# EAGLE design howland_vccs_differential (EAGLE 6.4)
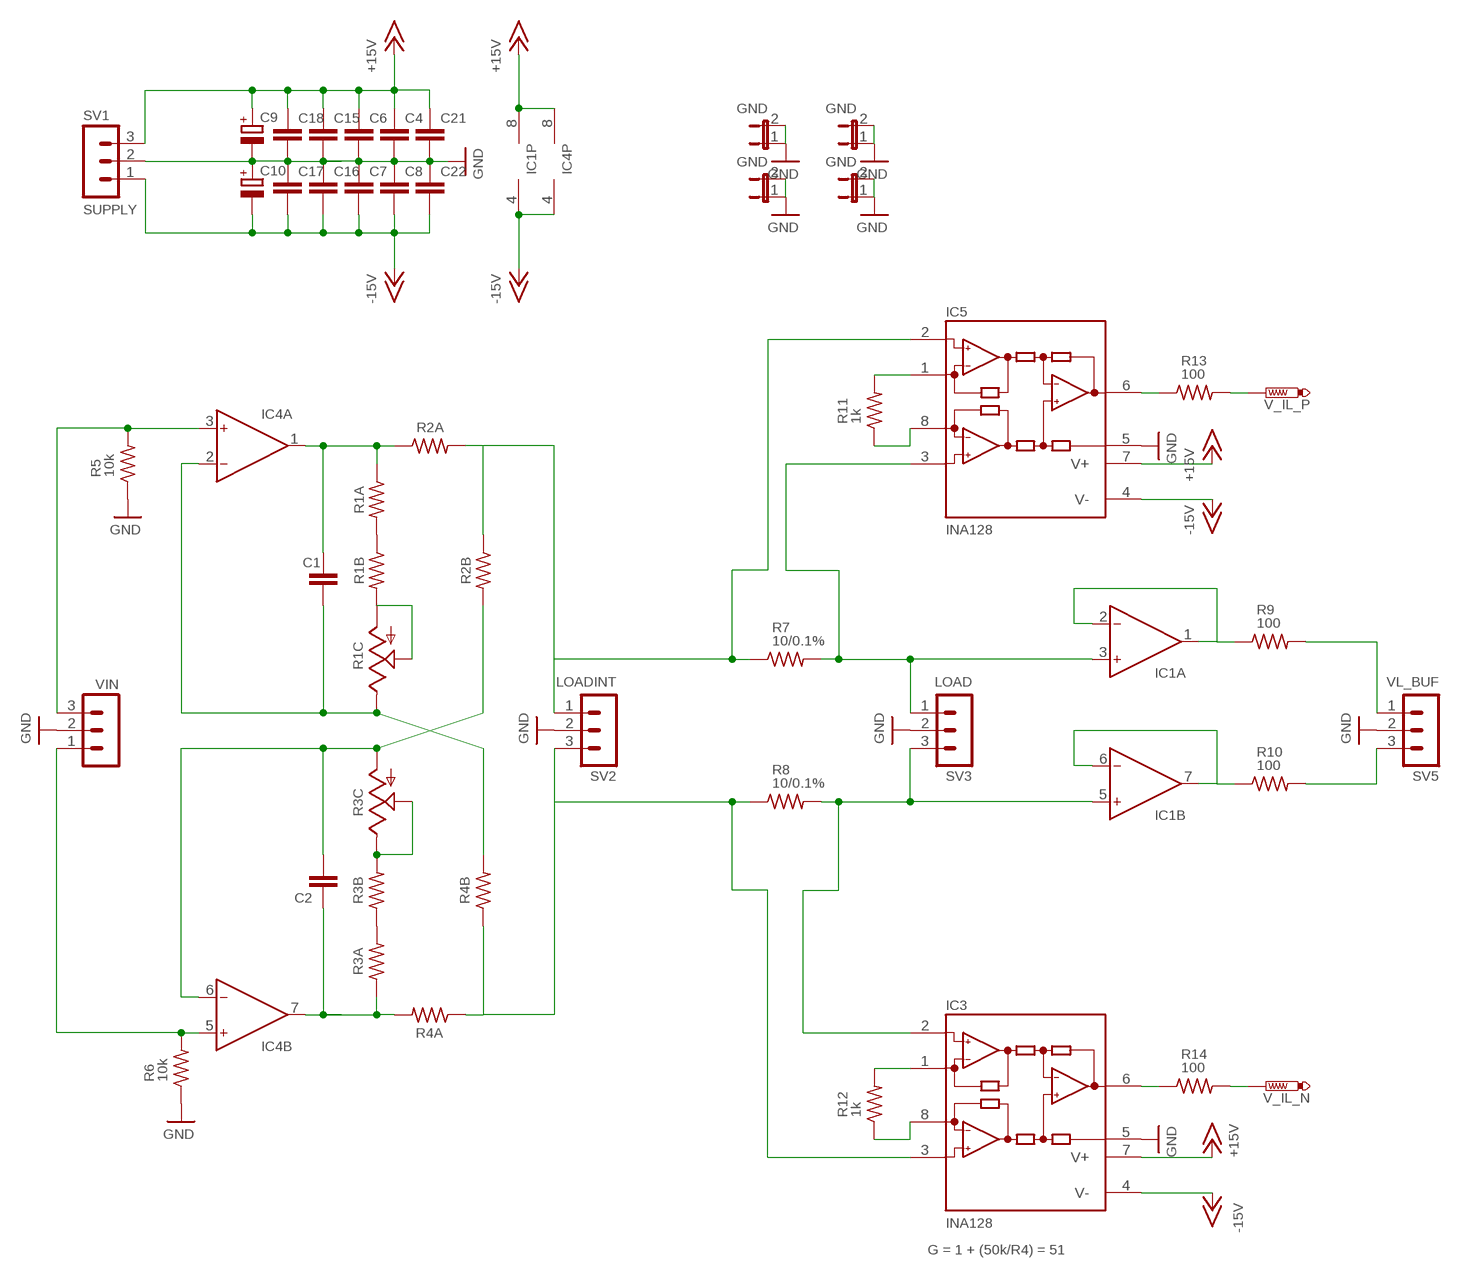
[diagram p0: schematic, sheet 1]

## Parts
C1  C-EUC1206  [C1206]
C2  C-EUC1206  [C1206]
C4  C-EUC1206  [C1206]
C6  C-EUC1206  [C1206]
C7  C-EUC1206  [C1206]
C8  C-EUC1206  [C1206]
C9  CPOL-EUC/6032-28R  [C/6032-28R]
C10  CPOL-EUC/6032-28R  [C/6032-28R]
C15  C-EUC1206  [C1206]
C16  C-EUC1206  [C1206]
C17  C-EUC1206  [C1206]
C18  C-EUC1206  [C1206]
C21  C-EUC1206  [C1206]
C22  C-EUC1206  [C1206]
IC1  OPA2192  AD826R  [SO8]
IC3  INA128  INA128U  [SO08]
IC4  OPA2192  AD826R  [SO8]
IC5  INA128  INA128U  [SO08]
JP8  GND  JP1E  [JP1]
JP10  GND  JP1E  [JP1]
JP11  GND  JP1E  [JP1]
JP12  GND  JP1E  [JP1]
R1A  R-US_R1206  [R1206]
R1B  R-US_R1206  [R1206]
R1C  TRIM_US-3223J  [3223J]
R2A  R-US_R1206  [R1206]
R2B  R-US_R1206  [R1206]
R3A  R-US_R1206  [R1206]
R3B  R-US_R1206  [R1206]
R3C  TRIM_US-3223J  [3223J]
R4A  R-US_R1206  [R1206]
R4B  R-US_R1206  [R1206]
R5  10k  R-US_R1206  [R1206]
R6  10k  R-US_R1206  [R1206]
R7  10/0.1%  R-US_R1206  [R1206]
R8  10/0.1%  R-US_R1206  [R1206]
R9  100  R-US_R1206  [R1206]
R10  100  R-US_R1206  [R1206]
R11  1k  R-US_R1206  [R1206]
R12  1k  R-US_R1206  [R1206]
R13  100  R-US_R1206  [R1206]
R14  100  R-US_R1206  [R1206]
SV1  SUPPLY  MA03-1  [MA03-1]
SV2  LOADINT  MA03-1  [MA03-1]
SV3  LOAD  MA03-1  [MA03-1]
SV5  VL_BUF  MA03-1  [MA03-1]
V_IL_N  PTR1PAD1-13  [P1-13]
V_IL_P  PTR1PAD1-13  [P1-13]
VIN  MA03-1  [MA03-1]

## Nets
+15V: C4.1 C6.1 C9.+ C15.1 C18.1 C21.1 IC1.8(P:V+) IC3.7(V+) IC4.8(P:V+) IC5.7(V+) SV1.3
-15V: C7.2 C8.2 C10.- C16.2 C17.2 C22.2 IC1.4(P:V-) IC3.4(V-) IC4.4(P:V-) IC5.4(V-) SV1.1
GND: C4.2 C6.2 C7.1 C8.1 C9.- C10.+ C15.2 C16.1 C17.1 C18.2 C21.2 C22.1 IC3.5(REF) IC5.5(REF) JP8.1 JP8.2 JP10.1 JP10.2 JP11.1 JP11.2 JP12.1 JP12.2 R5.1 R6.1 SV1.2 SV2.2 SV3.2 SV5.2 VIN.2
N$1: IC5.2(-IN) R2A.2 R2B.1 R7.1 SV2.1
N$2: C1.2 IC4.2(A:IN-) R1C.3(E) R4B.2
N$3: C1.1 IC4.1(A:OUT) R1A.1 R2A.1
N$5: IC1.6(B:IN-) IC1.7(B:OUT) R10.1
N$6: R1B.2 R1C.1(A) R1C.2(S)
N$7: IC3.1(RG) R12.2
N$8: IC3.8(RG) R12.1
N$9: IC3.6(OUT) R14.1
N$11: R1A.2 R1B.1
N$12: IC1.1(A:OUT) IC1.2(A:IN-) R9.1
N$14: IC4.5(B:IN+) R6.2 VIN.1
N$15: IC4.3(A:IN+) R5.2 VIN.3
N$16: R10.2 SV5.3
N$17: R14.2 V_IL_N.TP
N$18: R9.2 SV5.1
N$19: C2.2 IC4.6(B:IN-) R2B.2 R3C.1(A)
N$22: C2.1 IC4.7(B:OUT) R3A.1 R4A.2
N$24: R3B.2 R3C.2(S) R3C.3(E)
N$25: IC5.1(RG) R11.2
N$27: IC5.8(RG) R11.1
N$28: IC5.6(OUT) R13.1
N$29: R13.2 V_IL_P.TP
N$30: IC1.3(A:IN+) IC5.3(+IN) R7.2 SV3.1
N$31: R3A.2 R3B.1
N$38: IC3.3(+IN) R4A.1 R4B.1 R8.1 SV2.3
N$39: IC1.5(B:IN+) IC3.2(-IN) R8.2 SV3.3

## Notes on the sheet
- G = 1 + (50k/R4) = 51

## Library data of the parts
C1 C2 C4 C6-C8 C15-C18 C21 C22 = rcl:C-EU: CAPACITOR, European symbol
C9 C10 = rcl:CPOL-EU: POLARIZED CAPACITOR, European symbol
IC1 IC4 = analog-devices:AD826: High-Speed, Low-Power Dual Operational Amplifier Source: http://www.analog.com/static/imported-files/data_sheets/AD826.pdf; MF: ALTERA CORPORATION; MPN: AD826AR; OC_FARNELL: 1651291; OC_NEWARK: 05F7688
IC3 IC5 = burr-brown:INA128: Instrumentation Amplifiers Precision, Low Power; MF: TEXAS INSTRUMENTS; MPN: INA128U; OC_FARNELL: 1212413; OC_NEWARK: 35C1729
JP8 JP10-JP12 = jumper:JP1E: JUMPER
R1A R1B R2A R2B R3A R3B R4A R4B R5-R14 = rcl:R-US_: RESISTOR, American symbol
R1C R3C = pot:TRIM_US-: POTENTIOMETER
SV1 = con-lstb:MA03-1: PIN HEADER; OC_FARNELL: unknown; OC_NEWARK: unknown
SV2 SV3 SV5 VIN = sil_header_3:MA03-1: PIN HEADER; OC_FARNELL: unknown; OC_NEWARK: unknown
V_IL_N V_IL_P = testpad:PTR1: TEST PIN

## Board
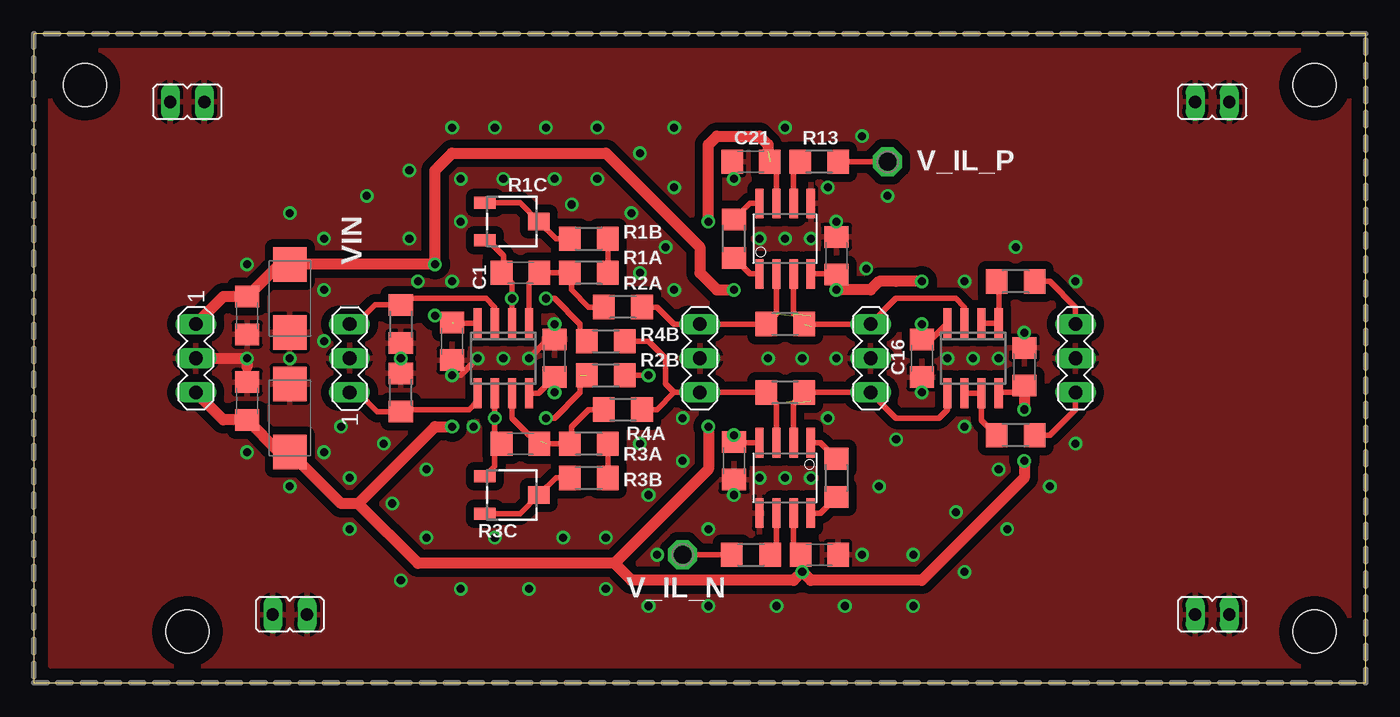
[diagram p1: board, top side]
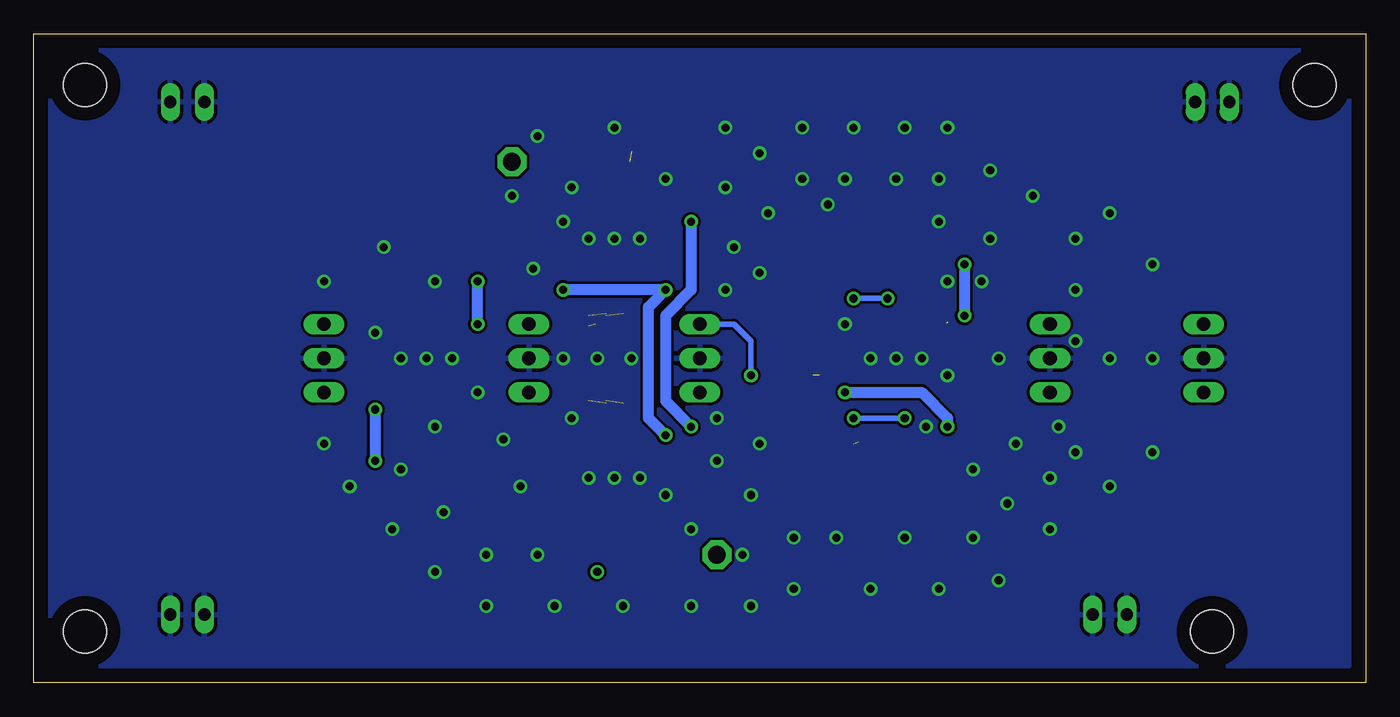
[diagram p2: board, bottom side, seen from below]

Size 99.06 x 48.26 mm. Coordinates in mm from the lower left corner, seen from the top.
Outline: 0,0 99.06,0 99.06,48.26 0,48.26 0,0
Copper layers (1*16): Top 0.035mm / dielectric 1.5mm / Bottom 0.035mm
Design rules "default *": minimum track width 10mil, minimum drill 24mil, track to track 8mil, track to pad 8mil, pad to pad 8mil, via to via 8mil, smd to smd 8mil, copper to edge 40mil, drill to drill 8mil, minimum pad ring 10mil, minimum via ring 8mil, stop-mask expansion 4mil, vias tented up to drill 0mil, thermal gap 10mil
Holes 3.2 mm at 3.81,44.45 95.25,44.45 11.43,3.81 95.25,3.81

### Footprints (pad centres in the part's own frame; a part is rotated, then mirrored left to right if it is on the bottom)
C1206 = smd 1.6 x 1.8: 1 -1.4,0; 2 1.4,0
C/6032-28R = smd 2.55 x 2.5: + 2.525,0; - -2.525,0
SO8 = smd 0.6 x 2.2: 1 -1.905,-2.6; 2 -0.635,-2.6; 3 0.635,-2.6; 4 1.905,-2.6; 5 1.905,2.6; 6 0.635,2.6; 7 -0.635,2.6; 8 -1.905,2.6
SO08 = smd 0.61 x 2.21: 1 -1.905,-2.616; 2 -0.635,-2.616; 3 0.635,-2.616; 4 1.905,-2.616; 5 1.905,2.616; 6 0.635,2.616; 7 -0.635,2.616; 8 -1.905,2.616
JP1 = drill 0.914 long: 1 0,-1.27; 2 0,1.27
R1206 = smd 1.6 x 1.803: 1 -1.422,0; 2 1.422,0
3223J = smd 1.6 x 0.9: 1 -2,1.4; 3 -2,-1.4 | smd 1.6 x 1.3: 2 2,0
MA03-1 = drill 1.016 long: 1 -2.54,0; 2 0,0; 3 2.54,0
P1-13 = drill 1.321 pad 2.159 octagon: TP 0,0

### Placement (x,y rotation side)
C1  36.2,30.48 180 top
C2  36.2,17.78 180 top
C4  38.73,24.13 90 top
C6  58.42,9.52 0 top
C7  52.07,16.51 90 top
C8  31.12,25.4 90 top
C9  19.05,19.68 270 top
C10  19.05,28.57 270 top
C15  73.66,23.49 90 top
C16  66.04,24.13 90 top
C17  15.88,27.3 90 top
C18  15.88,20.95 90 top
C21  53.34,38.73 180 top
C22  59.69,31.75 270 top
IC1  69.85,24.13 180 top
IC3  55.88,15.24 180 top
IC4  34.92,24.13 180 top
IC5  55.88,33.02 0 top
JP8  11.43,43.18 270 top
JP10  19.05,5.08 270 top
JP11  87.63,43.18 270 top
JP12  87.63,5.08 270 top
R1A  41.27,30.48 0 top
R1B  41.27,33.02 180 top
R1C  35.56,34.29 0 top
R2A  43.81,27.94 0 top
R2B  42.55,22.86 180 top
R3A  41.27,17.78 0 top
R3B  41.27,15.24 180 top
R3C  35.56,13.97 0 top
R4A  43.81,20.32 180 top
R4B  42.55,25.4 180 top
R5  27.3,26.67 90 top
R6  27.3,21.59 270 top
R7  55.88,26.67 0 top
R8  55.88,21.59 0 top
R9  73.03,29.84 0 top
R10  73.03,18.41 0 top
R11  52.07,33.02 270 top
R12  59.69,15.24 90 top
R13  58.42,38.73 0 top
R14  53.34,9.52 180 top
SV1  12.06,24.13 270 top
SV2  49.53,24.13 270 top
SV3  62.23,24.13 270 top
SV5  77.47,24.13 270 top
V_IL_N  48.26,9.52 0 top
V_IL_P  63.5,38.73 0 top
VIN  23.5,24.13 90 top

### Tracks (layer width: path | path; a pad name or v marks a point on that pad's centre or on a via)
+15V  (via drill 0.6)  (1 unrouted)
  Top 0.406: IC4.8 37.54,21.53 C4.1 v38.73,21.59 | IC5.7 55.25,38.23 C21.1 | C15.1 73.66,22.22 73.03,21.59 71.75,21.59 IC1.8 | IC3.7 56.52,10.16 57.02,9.65 C6.1 57.02,8.38 v57.15,8.25
  Top 0.813: 73.66,22.22 v73.66,20.32 | 24.13,13.33 29.85,19.05 v31.12,19.05 | 43.18,8.89 50.16,15.87 v50.16,19.05 | 43.18,8.89 28.58,8.89 24.13,13.33 | v73.66,16.51 73.66,15.24 66.04,7.62 57.79,7.62 v57.15,8.25 56.52,7.62 44.45,7.62 43.18,8.89 | v50.16,34.29 50.16,40 50.8,40.64 53.98,40.64 54.61,40 54.61,39.5 | SV1.3 14.1,19.55 C18.1 18.27,17.16 C9.+ 22.88,13.33 24.13,13.33
  Bottom 0.813: v73.66,20.32 v73.66,16.51 | v38.73,21.59 33.02,21.59 31.12,19.68 v31.12,19.05 | v50.16,34.29 50.16,29.21 52.07,27.3 52.07,20.95 v50.16,19.05
-15V  (via drill 0.6, 0.6 pad 0.25)  (1 unrouted)
  Top 0.406: IC4.4 31.19,26.73 | IC5.4 59.64,30.4 C22.2 | C22.2 59.69,30.48 | C22.2 v59.69,29.21 | IC1.4 66.62,25.4 66.04,25.4 C16.2 v66.04,26.67 | IC3.4 52.12,17.86 C7.2 52.07,17.78 | v29.85,27.3 30.61,27.3 C8.2
  Top 0.813: v66.04,29.84 64.14,29.84 62.87,29.84 62.23,29.21 v59.69,29.21 | v52.07,29.21 50.8,29.21 49.53,30.48 49.53,32.38 42.55,39.37 31.12,39.37 29.85,38.1 v29.85,31.11 19.07,31.11 C10.- 18.27,31.1 C17.2 14.1,28.7 SV1.1 | 52.07,17.78 v52.07,18.41
  Bottom 0.813: v59.69,29.21 v52.07,29.21 53.34,27.94 53.34,19.68 v52.07,18.41 | v66.04,26.67 v66.04,29.84 | v29.85,31.11 v29.85,27.3
GND  (via drill 0.6, 0.6 pad 0.25)
  Top 0.406: v36.83,24.13 38.73,26.04 v38.73,26.67 | v33.02,24.13 31.75,22.86 v31.12,22.86
  Top 0.813: SV1.2 v15.88,24.13 15.88,23.49
  other vias: 22.86,19.05 29.21,10.79 48.26,16.51 24.77,36.2 66.04,21.59 69.85,24.13 67.94,24.13 71.75,24.13 73.66,26.04 26.67,13.33 26.04,17.78 34.92,24.13 31.12,29.84 31.75,34.29 31.75,37.47 34.92,37.47 38.73,37.47 40.01,35.56 46.99,32.38 47.62,29.21 45.09,30.48 57.15,24.13 52.07,37.47 55.88,41.27 55.88,33.02 53.98,33.02 57.79,33.02 59.69,34.29 41.91,37.47 44.45,34.92 55.88,15.24 53.98,15.24 57.79,15.24 52.07,13.97 46.36,9.52 59.05,19.68 62.87,14.6 59.05,36.83 65.41,5.71 45.09,17.78 75.56,14.6 48.26,19.68 63.5,36.2 69.22,29.84 73.03,32.38 61.59,40.64 77.47,29.84 77.47,17.78 71.75,15.87 69.22,19.05 55.25,5.71 61.59,9.52 68.58,12.7 65.41,9.52 60.33,5.71 50.16,11.43 69.22,8.25 50.16,5.71 54.61,24.13 28.58,29.84 27.94,33.02 32.7,19.05 29.21,15.87 34.29,10.79 39.37,10.79 42.55,10.79 45.72,13.97 42.55,6.98 36.83,6.98 31.75,6.98 27.3,7.62 27.94,38.1 31.12,41.27 34.29,41.27 38.1,41.27 41.91,41.27 45.09,39.37 47.62,36.83 47.62,41.27 72.39,11.43 61.91,30.8 64.14,18.1 19.05,24.13 21.59,17.14 21.59,29.21 21.59,33.02 19.05,34.92 23.5,15.24 23.5,11.43 15.88,17.14 15.88,31.11 21.59,25.4 19.05,14.6 45.72,5.71 27.3,24.13 59.69,24.13
  pour Bottom: 1.27,46.99 97.79,46.99 97.79,1.27 1.27,1.27
  pour Top (isolate 0.61): 1.27,46.99 97.79,46.99 97.79,1.27 1.27,1.27
N$1  (via drill 0.6)  (1 unrouted)
  Top 0.406: v45.72,22.86 R2B.1 | R2A.2 46.36,27.94 47.62,26.67 SV2.1 R7.1 55.25,27.46 IC5.2
  Bottom 0.406: SV2.1 46.99,26.67 45.72,25.4 v45.72,22.86
N$2  (via drill 0.6)
  Top 0.406: IC4.2 v35.56,28.57 35.56,29.71 C1.2 34.92,30.61 34.92,31.75 33.79,32.89 R1C.3 | v38.1,28.57 38.73,28.57 40.64,26.67 40.64,25.88 R4B.2
  Bottom 0.406: v35.56,28.57 v38.1,28.57
N$3
  Top 0.406: IC4.1 36.83,29.71 C1.1 R1A.1 40.01,30.33 40.01,29.21 41.27,27.94 R2A.1
N$5
  Top 0.406: IC1.6 IC1.7 70.48,19.53 R10.1
N$6
  Top 0.406: R1B.2 38.83,33.02 R1C.2 36.16,35.69 R1C.1
N$7
  Top 0.406: IC3.1 58.5,17.86 R12.2
N$8
  Top 0.406: IC3.8 58.5,12.62 R12.1
N$9
  Top 0.406: IC3.6 55.25,10.01 R14.1
N$11
  Top 0.406: R1A.2 R1B.1
N$12
  Top 0.406: R9.1 71.75,29.69 IC1.1 IC1.2
N$14
  Top 0.406: IC4.5 33.02,20.95 32.39,20.32 27.46,20.32 R6.2 25.55,20.17 24.13,21.59 VIN.1
N$15
  Top 0.406: IC4.3 34.29,27.94 33.66,28.57 27.79,28.57 R5.2 25.4,28.09 23.98,26.67 VIN.3
N$16
  Top 0.406: R10.2 75.56,18.41 77.47,20.32 SV5.3
N$17
  Top 0.406: R14.2 V_IL_N.TP
N$18
  Top 0.406: R9.2 75.56,29.84 77.47,27.94 SV5.1
N$19  (via drill 0.6)  (1 unrouted)
  Top 0.406: IC4.6 v34.29,19.68 | v34.29,19.68 34.29,18.29 C2.2 34.29,17.78 | v34.29,19.68 34.29,17.78 | v38.1,19.68 38.73,19.68 40.64,21.59 40.64,22.86 | 34.29,17.78 34.29,16.1 R3C.1
  Bottom 0.406: v38.1,19.68 v34.29,19.68
N$22  (1 unrouted)
  Top 0.406: IC4.7 35.56,19.68 36.83,18.41 37.47,18.41 37.47,17.91 C2.1 37.75,17.93 | 38.1,17.78 R3A.1 40.01,17.93 40.01,19.05 41.27,20.32 R4A.2
N$24
  Top 0.406: R3B.2 38.83,15.24 R3C.2 36.16,12.57 R3C.3
N$25
  Top 0.406: IC5.1 53.26,30.4 R11.2
N$27
  Top 0.406: IC5.8 53.26,35.64 R11.1
N$28
  Top 0.406: IC5.6 56.52,38.25 R13.1
N$29
  Top 0.406: R13.2 V_IL_P.TP
N$30  (2 unrouted)
  Top 0.406: 57.79,26.52 57.79,26.67 SV3.1 64.14,28.57 68.58,28.57 69.22,27.94 IC1.3 | R7.2 56.52,27.46 IC5.3
N$31
  Top 0.406: R3A.2 R3B.1
N$38  (1 unrouted)
  Top 0.406: IC3.3 55.25,20.8 R8.1 SV2.3 47.62,21.59 | R4B.1 45.72,25.4 46.99,24.13 46.99,22.22 47.62,21.59 | R4A.1 46.36,20.32 47.62,21.59
N$39  (1 unrouted)
  Top 0.406: IC3.2 56.52,20.8 R8.2 SV3.3 64.14,19.68 67.31,19.68 67.94,20.32 IC1.5

### Text on the board
tDocu: Differential Howland VCCS | + | + | + | + | -15V | GND | +15V